# EAGLE schematic Adafruit IS31FL3741 Matrix (EAGLE 9.6.2)
COMPANY: ADAFRUIT INDUSTRIES; DRAWN: KTOWN; REV: A
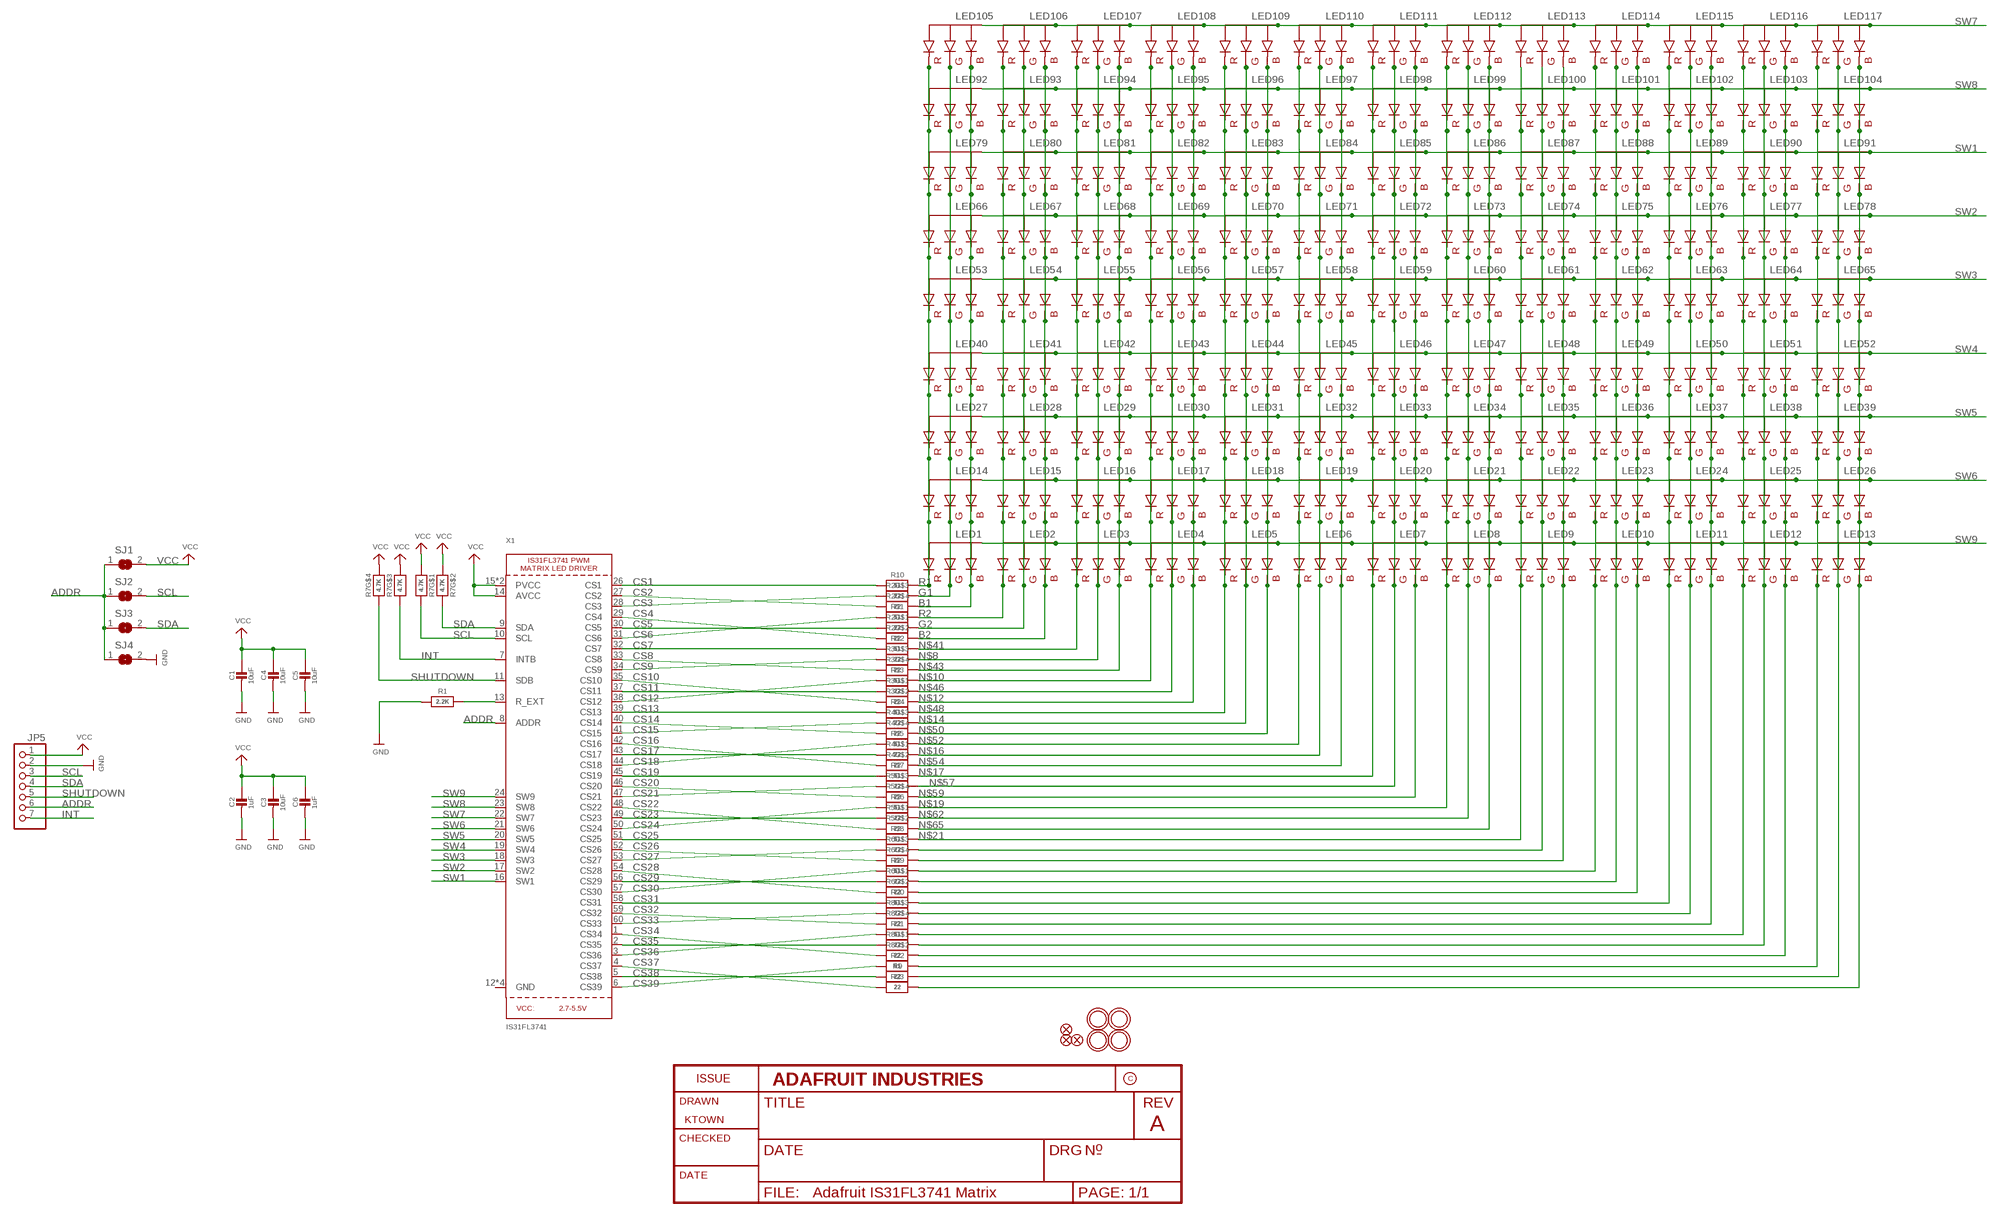
[diagram p0: schematic, sheet 1, part 1 of 2]
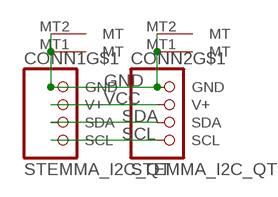
[diagram p1: schematic, sheet 1, part 2 of 2]

## Parts
C1  10uF  CAP_CERAMIC0805-NOOUTLINE  [0805-NO]
C2  1uF  CAP_CERAMIC0603_NO  [0603-NO]
C3  10uF  CAP_CERAMIC0805-NOOUTLINE  [0805-NO]
C4  10uF  CAP_CERAMIC0805-NOOUTLINE  [0805-NO]
C5  10uF  CAP_CERAMIC0805-NOOUTLINE  [0805-NO]
C6  1uF  CAP_CERAMIC0603_NO  [0603-NO]
CONN1  STEMMA_I2C_QT  [JST_SH4]
CONN2  STEMMA_I2C_QT  [JST_SH4]
FID1  FIDUCIAL_1MM  [FIDUCIAL_1MM]
FID2  FIDUCIAL_1MM  [FIDUCIAL_1MM]
FID3  FIDUCIAL_1MM  [FIDUCIAL_1MM]
JP5  HEADER-1X7THICKER  [1X07_ROUND_76]
LED1  RGBLED_CA_2121  [RGBLED_2121]
LED2  RGBLED_CA_2121  [RGBLED_2121]
LED3  RGBLED_CA_2121  [RGBLED_2121]
LED4  RGBLED_CA_2121  [RGBLED_2121]
LED5  RGBLED_CA_2121  [RGBLED_2121]
LED6  RGBLED_CA_2121  [RGBLED_2121]
LED7  RGBLED_CA_2121  [RGBLED_2121]
LED8  RGBLED_CA_2121  [RGBLED_2121]
LED9  RGBLED_CA_2121  [RGBLED_2121]
LED10  RGBLED_CA_2121  [RGBLED_2121]
LED11  RGBLED_CA_2121  [RGBLED_2121]
LED12  RGBLED_CA_2121  [RGBLED_2121]
LED13  RGBLED_CA_2121  [RGBLED_2121]
LED14  RGBLED_CA_2121  [RGBLED_2121]
LED15  RGBLED_CA_2121  [RGBLED_2121]
LED16  RGBLED_CA_2121  [RGBLED_2121]
LED17  RGBLED_CA_2121  [RGBLED_2121]
LED18  RGBLED_CA_2121  [RGBLED_2121]
LED19  RGBLED_CA_2121  [RGBLED_2121]
LED20  RGBLED_CA_2121  [RGBLED_2121]
LED21  RGBLED_CA_2121  [RGBLED_2121]
LED22  RGBLED_CA_2121  [RGBLED_2121]
LED23  RGBLED_CA_2121  [RGBLED_2121]
LED24  RGBLED_CA_2121  [RGBLED_2121]
LED25  RGBLED_CA_2121  [RGBLED_2121]
LED26  RGBLED_CA_2121  [RGBLED_2121]
LED27  RGBLED_CA_2121  [RGBLED_2121]
LED28  RGBLED_CA_2121  [RGBLED_2121]
LED29  RGBLED_CA_2121  [RGBLED_2121]
LED30  RGBLED_CA_2121  [RGBLED_2121]
LED31  RGBLED_CA_2121  [RGBLED_2121]
LED32  RGBLED_CA_2121  [RGBLED_2121]
LED33  RGBLED_CA_2121  [RGBLED_2121]
LED34  RGBLED_CA_2121  [RGBLED_2121]
LED35  RGBLED_CA_2121  [RGBLED_2121]
LED36  RGBLED_CA_2121  [RGBLED_2121]
LED37  RGBLED_CA_2121  [RGBLED_2121]
LED38  RGBLED_CA_2121  [RGBLED_2121]
LED39  RGBLED_CA_2121  [RGBLED_2121]
LED40  RGBLED_CA_2121  [RGBLED_2121]
LED41  RGBLED_CA_2121  [RGBLED_2121]
LED42  RGBLED_CA_2121  [RGBLED_2121]
LED43  RGBLED_CA_2121  [RGBLED_2121]
LED44  RGBLED_CA_2121  [RGBLED_2121]
LED45  RGBLED_CA_2121  [RGBLED_2121]
LED46  RGBLED_CA_2121  [RGBLED_2121]
LED47  RGBLED_CA_2121  [RGBLED_2121]
LED48  RGBLED_CA_2121  [RGBLED_2121]
LED49  RGBLED_CA_2121  [RGBLED_2121]
LED50  RGBLED_CA_2121  [RGBLED_2121]
LED51  RGBLED_CA_2121  [RGBLED_2121]
LED52  RGBLED_CA_2121  [RGBLED_2121]
LED53  RGBLED_CA_2121  [RGBLED_2121]
LED54  RGBLED_CA_2121  [RGBLED_2121]
LED55  RGBLED_CA_2121  [RGBLED_2121]
LED56  RGBLED_CA_2121  [RGBLED_2121]
LED57  RGBLED_CA_2121  [RGBLED_2121]
LED58  RGBLED_CA_2121  [RGBLED_2121]
LED59  RGBLED_CA_2121  [RGBLED_2121]
LED60  RGBLED_CA_2121  [RGBLED_2121]
LED61  RGBLED_CA_2121  [RGBLED_2121]
LED62  RGBLED_CA_2121  [RGBLED_2121]
LED63  RGBLED_CA_2121  [RGBLED_2121]
LED64  RGBLED_CA_2121  [RGBLED_2121]
LED65  RGBLED_CA_2121  [RGBLED_2121]
LED66  RGBLED_CA_2121  [RGBLED_2121]
LED67  RGBLED_CA_2121  [RGBLED_2121]
LED68  RGBLED_CA_2121  [RGBLED_2121]
LED69  RGBLED_CA_2121  [RGBLED_2121]
LED70  RGBLED_CA_2121  [RGBLED_2121]
LED71  RGBLED_CA_2121  [RGBLED_2121]
LED72  RGBLED_CA_2121  [RGBLED_2121]
LED73  RGBLED_CA_2121  [RGBLED_2121]
LED74  RGBLED_CA_2121  [RGBLED_2121]
LED75  RGBLED_CA_2121  [RGBLED_2121]
LED76  RGBLED_CA_2121  [RGBLED_2121]
LED77  RGBLED_CA_2121  [RGBLED_2121]
LED78  RGBLED_CA_2121  [RGBLED_2121]
LED79  RGBLED_CA_2121  [RGBLED_2121]
LED80  RGBLED_CA_2121  [RGBLED_2121]
LED81  RGBLED_CA_2121  [RGBLED_2121]
LED82  RGBLED_CA_2121  [RGBLED_2121]
LED83  RGBLED_CA_2121  [RGBLED_2121]
LED84  RGBLED_CA_2121  [RGBLED_2121]
LED85  RGBLED_CA_2121  [RGBLED_2121]
LED86  RGBLED_CA_2121  [RGBLED_2121]
LED87  RGBLED_CA_2121  [RGBLED_2121]
LED88  RGBLED_CA_2121  [RGBLED_2121]
LED89  RGBLED_CA_2121  [RGBLED_2121]
LED90  RGBLED_CA_2121  [RGBLED_2121]
LED91  RGBLED_CA_2121  [RGBLED_2121]
LED92  RGBLED_CA_2121  [RGBLED_2121]
LED93  RGBLED_CA_2121  [RGBLED_2121]
LED94  RGBLED_CA_2121  [RGBLED_2121]
LED95  RGBLED_CA_2121  [RGBLED_2121]
LED96  RGBLED_CA_2121  [RGBLED_2121]
LED97  RGBLED_CA_2121  [RGBLED_2121]
LED98  RGBLED_CA_2121  [RGBLED_2121]
LED99  RGBLED_CA_2121  [RGBLED_2121]
LED100  RGBLED_CA_2121  [RGBLED_2121]
LED101  RGBLED_CA_2121  [RGBLED_2121]
LED102  RGBLED_CA_2121  [RGBLED_2121]
LED103  RGBLED_CA_2121  [RGBLED_2121]
LED104  RGBLED_CA_2121  [RGBLED_2121]
LED105  RGBLED_CA_2121  [RGBLED_2121]
LED106  RGBLED_CA_2121  [RGBLED_2121]
LED107  RGBLED_CA_2121  [RGBLED_2121]
LED108  RGBLED_CA_2121  [RGBLED_2121]
LED109  RGBLED_CA_2121  [RGBLED_2121]
LED110  RGBLED_CA_2121  [RGBLED_2121]
LED111  RGBLED_CA_2121  [RGBLED_2121]
LED112  RGBLED_CA_2121  [RGBLED_2121]
LED113  RGBLED_CA_2121  [RGBLED_2121]
LED114  RGBLED_CA_2121  [RGBLED_2121]
LED115  RGBLED_CA_2121  [RGBLED_2121]
LED116  RGBLED_CA_2121  [RGBLED_2121]
LED117  RGBLED_CA_2121  [RGBLED_2121]
R1  2.2K  RESISTOR_0603_NOOUT  [0603-NO]
R2  22  RESISTOR_4PACK  [RESPACK_4X0603]
R3  22  RESISTOR_4PACK  [RESPACK_4X0603]
R4  22  RESISTOR_4PACK  [RESPACK_4X0603]
R5  22  RESISTOR_4PACK  [RESPACK_4X0603]
R6  22  RESISTOR_4PACK  [RESPACK_4X0603]
R7  4.7K  RESISTOR_4PACK  [RESPACK_4X0603]
R8  22  RESISTOR_4PACK  [RESPACK_4X0603]
R9  22  RESISTOR_0603_NOOUT  [0603-NO]
R10  51  RESISTOR_0603_NOOUT  [0603-NO]
R11  51  RESISTOR_0603_NOOUT  [0603-NO]
R12  51  RESISTOR_0603_NOOUT  [0603-NO]
R13  51  RESISTOR_0603_NOOUT  [0603-NO]
R14  51  RESISTOR_0603_NOOUT  [0603-NO]
R15  51  RESISTOR_0603_NOOUT  [0603-NO]
R16  51  RESISTOR_0603_NOOUT  [0603-NO]
R17  51  RESISTOR_0603_NOOUT  [0603-NO]
R18  51  RESISTOR_0603_NOOUT  [0603-NO]
R19  51  RESISTOR_0603_NOOUT  [0603-NO]
R20  51  RESISTOR_0603_NOOUT  [0603-NO]
R21  51  RESISTOR_0603_NOOUT  [0603-NO]
R22  51  RESISTOR_0603_NOOUT  [0603-NO]
R23  22  RESISTOR_0603_NOOUT  [0603-NO]
SJ1  SOLDERJUMPER  [SOLDERJUMPER_ARROW_NOPASTE]
SJ2  SOLDERJUMPER  [SOLDERJUMPER_ARROW_NOPASTE]
SJ3  SOLDERJUMPER  [SOLDERJUMPER_ARROW_NOPASTE]
SJ4  SOLDERJUMPERCLOSED  [SOLDERJUMPER_CLOSEDWIRE]
U$3  MOUNTINGHOLE2.5  [MOUNTINGHOLE_2.5_PLATED]
U$4  MOUNTINGHOLE2.5  [MOUNTINGHOLE_2.5_PLATED]
U$5  MOUNTINGHOLE2.5  [MOUNTINGHOLE_2.5_PLATED]
U$6  MOUNTINGHOLE2.5  [MOUNTINGHOLE_2.5_PLATED]
X1  IS31FL3741  [QFN60_7MM]

## Nets
ADDR: JP5.6 SJ1.1 SJ2.1 SJ3.1 SJ4.1 X1.8(ADDR)
B1: LED1.B(BLUE) LED14.B(BLUE) LED27.B(BLUE) LED40.B(BLUE) LED53.B(BLUE) LED66.B(BLUE) LED79.B(BLUE) LED92.B(BLUE) LED105.B(BLUE) R2.5
B2: LED2.B(BLUE) LED15.B(BLUE) LED28.B(BLUE) LED41.B(BLUE) LED54.B(BLUE) LED67.B(BLUE) LED80.B(BLUE) LED93.B(BLUE) LED106.B(BLUE) R2.7
CS1: R10.1 X1.26(CS1)
CS2: R2.4 X1.27(CS2)
CS3: R2.3 X1.28(CS3)
CS4: R2.2 X1.29(CS4)
CS5: R2.1 X1.30(CS5)
CS6: R11.1 X1.31(CS6)
CS7: R12.1 X1.32(CS7)
CS8: R3.4 X1.33(CS8)
CS9: R3.3 X1.34(CS9)
CS10: R3.2 X1.35(CS10)
CS11: R3.1 X1.37(CS11)
CS12: R13.1 X1.38(CS12)
CS13: R14.1 X1.39(CS13)
CS14: R4.4 X1.40(CS14)
CS15: R4.3 X1.41(CS15)
CS16: R4.2 X1.42(CS16)
CS17: R4.1 X1.43(CS17)
CS18: R15.1 X1.44(CS18)
CS19: R17.1 X1.45(CS19)
CS20: R5.4 X1.46(CS20)
CS21: R5.3 X1.47(CS21)
CS22: R5.2 X1.48(CS22)
CS23: R5.1 X1.49(CS23)
CS24: R16.1 X1.50(CS24)
CS25: R18.1 X1.51(CS25)
CS26: R6.4 X1.52(CS26)
CS27: R6.3 X1.53(CS27)
CS28: R6.2 X1.54(CS28)
CS29: R6.1 X1.56(CS29)
CS30: R19.1 X1.57(CS30)
CS31: R20.1 X1.58(CS31)
CS32: R8.4 X1.59(CS32)
CS33: R8.3 X1.60(CS33)
CS34: R8.2 X1.1(CS34)
CS35: R8.1 X1.2(CS35)
CS36: R21.1 X1.3(CS36)
CS37: R23.1 X1.4(CS37)
CS38: R9.1 X1.5(CS38)
CS39: R22.1 X1.6(CS39)
G1: LED1.G(GREEN) LED14.G(GREEN) LED27.G(GREEN) LED40.G(GREEN) LED53.G(GREEN) LED66.G(GREEN) LED79.G(GREEN) LED92.G(GREEN) LED105.G(GREEN) R2.6
G2: LED2.G(GREEN) LED15.G(GREEN) LED28.G(GREEN) LED41.G(GREEN) LED54.G(GREEN) LED67.G(GREEN) LED80.G(GREEN) LED93.G(GREEN) LED106.G(GREEN) R2.8
GND: C1.2 C2.2 C3.2 C4.2 C5.2 C6.2 CONN1.1(GND) CONN1.MT1(MT) CONN1.MT2(MT) CONN2.1(GND) CONN2.MT1(MT) CONN2.MT2(MT) JP5.2 R1.1 SJ4.2
INT: JP5.7 R7.3 X1.7(INTB)
N$4: R1.2 X1.13(R_EXT)
N$8: LED3.G(GREEN) LED16.G(GREEN) LED29.G(GREEN) LED42.G(GREEN) LED55.G(GREEN) LED68.G(GREEN) LED81.G(GREEN) LED94.G(GREEN) LED107.G(GREEN) R3.6
N$10: LED4.R(RED) LED17.R(RED) LED30.R(RED) LED43.R(RED) LED56.R(RED) LED69.R(RED) LED82.R(RED) LED95.R(RED) LED108.R(RED) R13.2
N$12: LED4.B(BLUE) LED17.B(BLUE) LED30.B(BLUE) LED43.B(BLUE) LED56.B(BLUE) LED69.B(BLUE) LED82.B(BLUE) LED95.B(BLUE) LED108.B(BLUE) R3.7
N$14: LED5.G(GREEN) LED18.G(GREEN) LED31.G(GREEN) LED44.G(GREEN) LED57.G(GREEN) LED70.G(GREEN) LED83.G(GREEN) LED96.G(GREEN) LED109.G(GREEN) R4.6
N$16: LED6.G(GREEN) LED19.G(GREEN) LED32.G(GREEN) LED45.G(GREEN) LED58.G(GREEN) LED71.G(GREEN) LED84.G(GREEN) LED97.G(GREEN) LED110.G(GREEN) R4.8
N$17: LED7.R(RED) LED20.R(RED) LED33.R(RED) LED46.R(RED) LED59.R(RED) LED72.R(RED) LED85.R(RED) LED98.R(RED) LED111.R(RED) R17.2
N$19: LED8.R(RED) LED21.R(RED) LED34.R(RED) LED47.R(RED) LED60.R(RED) LED73.R(RED) LED86.R(RED) LED99.R(RED) LED112.R(RED) R16.2
N$21: LED9.R(RED) LED22.R(RED) LED35.R(RED) LED48.R(RED) LED61.R(RED) LED74.R(RED) LED87.R(RED) LED100.R(RED) LED113.R(RED) R18.2
N$22: LED9.B(BLUE) LED22.B(BLUE) LED35.B(BLUE) LED48.B(BLUE) LED61.B(BLUE) LED74.B(BLUE) LED87.B(BLUE) LED100.B(BLUE) LED113.B(BLUE) R6.5
N$24: LED10.G(GREEN) LED23.G(GREEN) LED36.G(GREEN) LED49.G(GREEN) LED62.G(GREEN) LED75.G(GREEN) LED88.G(GREEN) LED101.G(GREEN) LED114.G(GREEN) R6.8
N$25: LED11.R(RED) LED24.R(RED) LED37.R(RED) LED50.R(RED) LED63.R(RED) LED76.R(RED) LED89.R(RED) LED102.R(RED) LED115.R(RED) R20.2
N$27: LED11.B(BLUE) LED24.B(BLUE) LED37.B(BLUE) LED50.B(BLUE) LED63.B(BLUE) LED76.B(BLUE) LED89.B(BLUE) LED102.B(BLUE) LED115.B(BLUE) R8.5
N$29: LED12.G(GREEN) LED25.G(GREEN) LED38.G(GREEN) LED51.G(GREEN) LED64.G(GREEN) LED77.G(GREEN) LED90.G(GREEN) LED103.G(GREEN) LED116.G(GREEN) R8.8
N$31: LED13.R(RED) LED26.R(RED) LED39.R(RED) LED52.R(RED) LED65.R(RED) LED78.R(RED) LED91.R(RED) LED104.R(RED) LED117.R(RED) R22.2
N$33: LED13.B(BLUE) LED26.B(BLUE) LED39.B(BLUE) LED52.B(BLUE) LED65.B(BLUE) LED78.B(BLUE) LED91.B(BLUE) LED104.B(BLUE) LED117.B(BLUE) R23.2
N$41: LED3.R(RED) LED16.R(RED) LED29.R(RED) LED42.R(RED) LED55.R(RED) LED68.R(RED) LED81.R(RED) LED94.R(RED) LED107.R(RED) R12.2
N$43: LED3.B(BLUE) LED16.B(BLUE) LED29.B(BLUE) LED42.B(BLUE) LED55.B(BLUE) LED68.B(BLUE) LED81.B(BLUE) LED94.B(BLUE) LED107.B(BLUE) R3.5
N$46: LED4.G(GREEN) LED17.G(GREEN) LED30.G(GREEN) LED43.G(GREEN) LED56.G(GREEN) LED69.G(GREEN) LED82.G(GREEN) LED95.G(GREEN) LED108.G(GREEN) R3.8
N$48: LED5.R(RED) LED18.R(RED) LED31.R(RED) LED44.R(RED) LED57.R(RED) LED70.R(RED) LED83.R(RED) LED96.R(RED) LED109.R(RED) R14.2
N$50: LED5.B(BLUE) LED18.B(BLUE) LED31.B(BLUE) LED44.B(BLUE) LED57.B(BLUE) LED70.B(BLUE) LED83.B(BLUE) LED96.B(BLUE) LED109.B(BLUE) R4.5
N$52: LED6.R(RED) LED19.R(RED) LED32.R(RED) LED45.R(RED) LED58.R(RED) LED71.R(RED) LED84.R(RED) LED97.R(RED) LED110.R(RED) R15.2
N$54: LED6.B(BLUE) LED19.B(BLUE) LED32.B(BLUE) LED45.B(BLUE) LED58.B(BLUE) LED71.B(BLUE) LED84.B(BLUE) LED97.B(BLUE) LED110.B(BLUE) R4.7
N$57: LED7.G(GREEN) LED20.G(GREEN) LED33.G(GREEN) LED46.G(GREEN) LED59.G(GREEN) LED72.G(GREEN) LED85.G(GREEN) LED98.G(GREEN) LED111.G(GREEN) R5.6
N$59: LED7.B(BLUE) LED20.B(BLUE) LED33.B(BLUE) LED46.B(BLUE) LED59.B(BLUE) LED72.B(BLUE) LED85.B(BLUE) LED98.B(BLUE) LED111.B(BLUE) R5.5
N$62: LED8.G(GREEN) LED21.G(GREEN) LED34.G(GREEN) LED47.G(GREEN) LED60.G(GREEN) LED73.G(GREEN) LED86.G(GREEN) LED99.G(GREEN) LED112.G(GREEN) R5.8
N$65: LED8.B(BLUE) LED21.B(BLUE) LED34.B(BLUE) LED47.B(BLUE) LED60.B(BLUE) LED73.B(BLUE) LED86.B(BLUE) LED99.B(BLUE) LED112.B(BLUE) R5.7
N$67: LED9.G(GREEN) LED22.G(GREEN) LED35.G(GREEN) LED48.G(GREEN) LED61.G(GREEN) LED74.G(GREEN) LED87.G(GREEN) LED100.G(GREEN) LED113.G(GREEN) R6.6
N$69: LED10.R(RED) LED23.R(RED) LED36.R(RED) LED49.R(RED) LED62.R(RED) LED75.R(RED) LED88.R(RED) LED101.R(RED) LED114.R(RED) R19.2
N$71: LED10.B(BLUE) LED23.B(BLUE) LED36.B(BLUE) LED49.B(BLUE) LED62.B(BLUE) LED75.B(BLUE) LED88.B(BLUE) LED101.B(BLUE) LED114.B(BLUE) R6.7
N$73: LED11.G(GREEN) LED24.G(GREEN) LED37.G(GREEN) LED50.G(GREEN) LED63.G(GREEN) LED76.G(GREEN) LED89.G(GREEN) LED102.G(GREEN) LED115.G(GREEN) R8.6
N$75: LED12.R(RED) LED25.R(RED) LED38.R(RED) LED51.R(RED) LED64.R(RED) LED77.R(RED) LED90.R(RED) LED103.R(RED) LED116.R(RED) R21.2
N$77: LED12.B(BLUE) LED25.B(BLUE) LED38.B(BLUE) LED51.B(BLUE) LED64.B(BLUE) LED77.B(BLUE) LED90.B(BLUE) LED103.B(BLUE) LED116.B(BLUE) R8.7
N$79: LED13.G(GREEN) LED26.G(GREEN) LED39.G(GREEN) LED52.G(GREEN) LED65.G(GREEN) LED78.G(GREEN) LED91.G(GREEN) LED104.G(GREEN) LED117.G(GREEN) R9.2
R1: LED1.R(RED) LED14.R(RED) LED27.R(RED) LED40.R(RED) LED53.R(RED) LED66.R(RED) LED79.R(RED) LED92.R(RED) LED105.R(RED) R10.2
R2: LED2.R(RED) LED15.R(RED) LED28.R(RED) LED41.R(RED) LED54.R(RED) LED67.R(RED) LED80.R(RED) LED93.R(RED) LED106.R(RED) R11.2
SCL: CONN1.4(SCL) CONN2.4(SCL) JP5.3 R7.8 SJ2.2 X1.10(SCL)
SDA: CONN1.3(SDA) CONN2.3(SDA) JP5.4 R7.7 SJ3.2 X1.9(SDA)
SHUTDOWN: JP5.5 R7.4 X1.11(SDB)
SW1: LED79.A(VCC) LED80.A(VCC) LED81.A(VCC) LED82.A(VCC) LED83.A(VCC) LED84.A(VCC) LED85.A(VCC) LED86.A(VCC) LED87.A(VCC) LED88.A(VCC) LED89.A(VCC) LED90.A(VCC) LED91.A(VCC) X1.16(SW1)
SW2: LED66.A(VCC) LED67.A(VCC) LED68.A(VCC) LED69.A(VCC) LED70.A(VCC) LED71.A(VCC) LED72.A(VCC) LED73.A(VCC) LED74.A(VCC) LED75.A(VCC) LED76.A(VCC) LED77.A(VCC) LED78.A(VCC) X1.17(SW2)
SW3: LED53.A(VCC) LED54.A(VCC) LED55.A(VCC) LED56.A(VCC) LED57.A(VCC) LED58.A(VCC) LED59.A(VCC) LED60.A(VCC) LED61.A(VCC) LED62.A(VCC) LED63.A(VCC) LED64.A(VCC) LED65.A(VCC) X1.18(SW3)
SW4: LED40.A(VCC) LED41.A(VCC) LED42.A(VCC) LED43.A(VCC) LED44.A(VCC) LED45.A(VCC) LED46.A(VCC) LED47.A(VCC) LED48.A(VCC) LED49.A(VCC) LED50.A(VCC) LED51.A(VCC) LED52.A(VCC) X1.19(SW4)
SW5: LED27.A(VCC) LED28.A(VCC) LED29.A(VCC) LED30.A(VCC) LED31.A(VCC) LED32.A(VCC) LED33.A(VCC) LED34.A(VCC) LED35.A(VCC) LED36.A(VCC) LED37.A(VCC) LED38.A(VCC) LED39.A(VCC) X1.20(SW5)
SW6: LED14.A(VCC) LED15.A(VCC) LED16.A(VCC) LED17.A(VCC) LED18.A(VCC) LED19.A(VCC) LED20.A(VCC) LED21.A(VCC) LED22.A(VCC) LED23.A(VCC) LED24.A(VCC) LED25.A(VCC) LED26.A(VCC) X1.21(SW6)
SW7: LED105.A(VCC) LED106.A(VCC) LED107.A(VCC) LED108.A(VCC) LED109.A(VCC) LED110.A(VCC) LED111.A(VCC) LED112.A(VCC) LED113.A(VCC) LED114.A(VCC) LED115.A(VCC) LED116.A(VCC) LED117.A(VCC) X1.22(SW7)
SW8: LED92.A(VCC) LED93.A(VCC) LED94.A(VCC) LED95.A(VCC) LED96.A(VCC) LED97.A(VCC) LED98.A(VCC) LED99.A(VCC) LED100.A(VCC) LED101.A(VCC) LED102.A(VCC) LED103.A(VCC) LED104.A(VCC) X1.23(SW8)
SW9: LED1.A(VCC) LED2.A(VCC) LED3.A(VCC) LED4.A(VCC) LED5.A(VCC) LED6.A(VCC) LED7.A(VCC) LED8.A(VCC) LED9.A(VCC) LED10.A(VCC) LED11.A(VCC) LED12.A(VCC) LED13.A(VCC) X1.24(SW9)
VCC [vcc]: C1.1 C2.1 C3.1 C4.1 C5.1 C6.1 CONN1.2(V+) CONN2.2(V+) JP5.1 R7.1 R7.2 R7.5 R7.6 SJ1.2 X1.14(AVCC) X1.15(PVCC) X1.25(PVCC)

## Power pins joined to a net without a drawn wire
GND: X1.12(GND) X1.36(GND) X1.55(GND) X1.THERMAL(GND)

## Library data of the parts
C1-C6 = microbuilder:CAP_CERAMIC: Ceramic Capacitors For new designs, use the packages preceded by an '_' character since they are more reliable: The following footprints should be used on most boards: _0402 - Standard footprint for regular board layouts _0603 - Standard footprint for regular board layouts _0805 - Standard footprint for regular board layouts _1206 - Standard footprint for regular board layouts For extremely tight-pitch boards where space is at a premium, the following 'micro-pitch' footprints can be used (smaller pads, no silkscreen outline, etc.): _0402MP - Micro-pitch footprint for very dense/compact boards _0603MP - Micro-pitch footprint for very dense/compact boards _0805MP - Micro-pitch footprint for very dense/compact boards _1206MP - Micro-pitch footprint for very dense/compact boards
CONN1 CONN2 = microbuilder:STEMMA_I2C
FID1-FID3 = microbuilder:FIDUCIAL: Fiducial Alignment Points Various fiducial points for machine vision alignment.; BOM: EXCLUDE
JP5 = microbuilder:HEADER-1X7: PIN HEADER
LED1-LED117 = microbuilder:RGBLED_CA: RGB LED, common-anode 5MM Staggered pins 5mm Piranha package http://www.ladyada.net/library/pcb/eaglelibrary.html
R1 R9-R23 = microbuilder:RESISTOR: Resistors For new designs, use the packages preceded by an '_' character since they are more reliable: The following footprints should be used on most boards: _0402 - Standard footprint for regular board layouts _0603 - Standard footprint for regular board layouts _0805 - Standard footprint for regular board layouts _1206 - Standard footprint for regular board layouts For extremely tight-pitch boards where space is at a premium, the following 'micro-pitch' footprints can be used (smaller pads, no silkscreen outline, etc.): _0402MP - Micro-pitch footprint for very dense/compact boards _0603MP - Micro-pitch footprint for very dense/compact boards _0805MP - Micro-pitch footprint for very dense/compact boards _1206MP - Micro-pitch footprint for very dense/compact boards
R2-R8 = microbuilder:RESISTOR_4PACK: Resistor Packs (4 resistors) 4 x 0603 10K 1/16W - Digikey: YC164J-10KCT-ND
SJ1-SJ3 = microbuilder:SOLDERJUMPER: SMD Solder JUMPER Solder the two pads together to create a connection, or remove the solder to break it. REFLOW - Use this footprint for solder paste and reflow ovens. WAVE - Use this footprint for hand-soldering (larger pads). CLOSED - Has a trace between the two pads to ensure it is closed by default. The trace needs to be cut to disable the jumper, and can be closed again by creating a solder bridge between the two pads.; BOM: EXCLUDE
SJ4 = microbuilder:SOLDERJUMPER: SMD Solder JUMPER Solder the two pads together to create a connection, or remove the solder to break it. REFLOW - Use this footprint for solder paste and reflow ovens. WAVE - Use this footprint for hand-soldering (larger pads). CLOSED - Has a trace between the two pads to ensure it is closed by default. The trace needs to be cut to disable the jumper, and can be closed again by creating a solder bridge between the two pads.
U$3-U$6 = microbuilder:MOUNTINGHOLE: Mounting Hole For #2 screws (0.086"/2.18mm width, 0.094"/2.4mm hole) use 2.5mm; BOM: EXCLUDE
X1 = microbuilder:IS31FL3741

## Net classes
1 vcc: width 0.305 mm